# EAGLE schematic Pull out testing jig_modified (EAGLE 7.2.0)
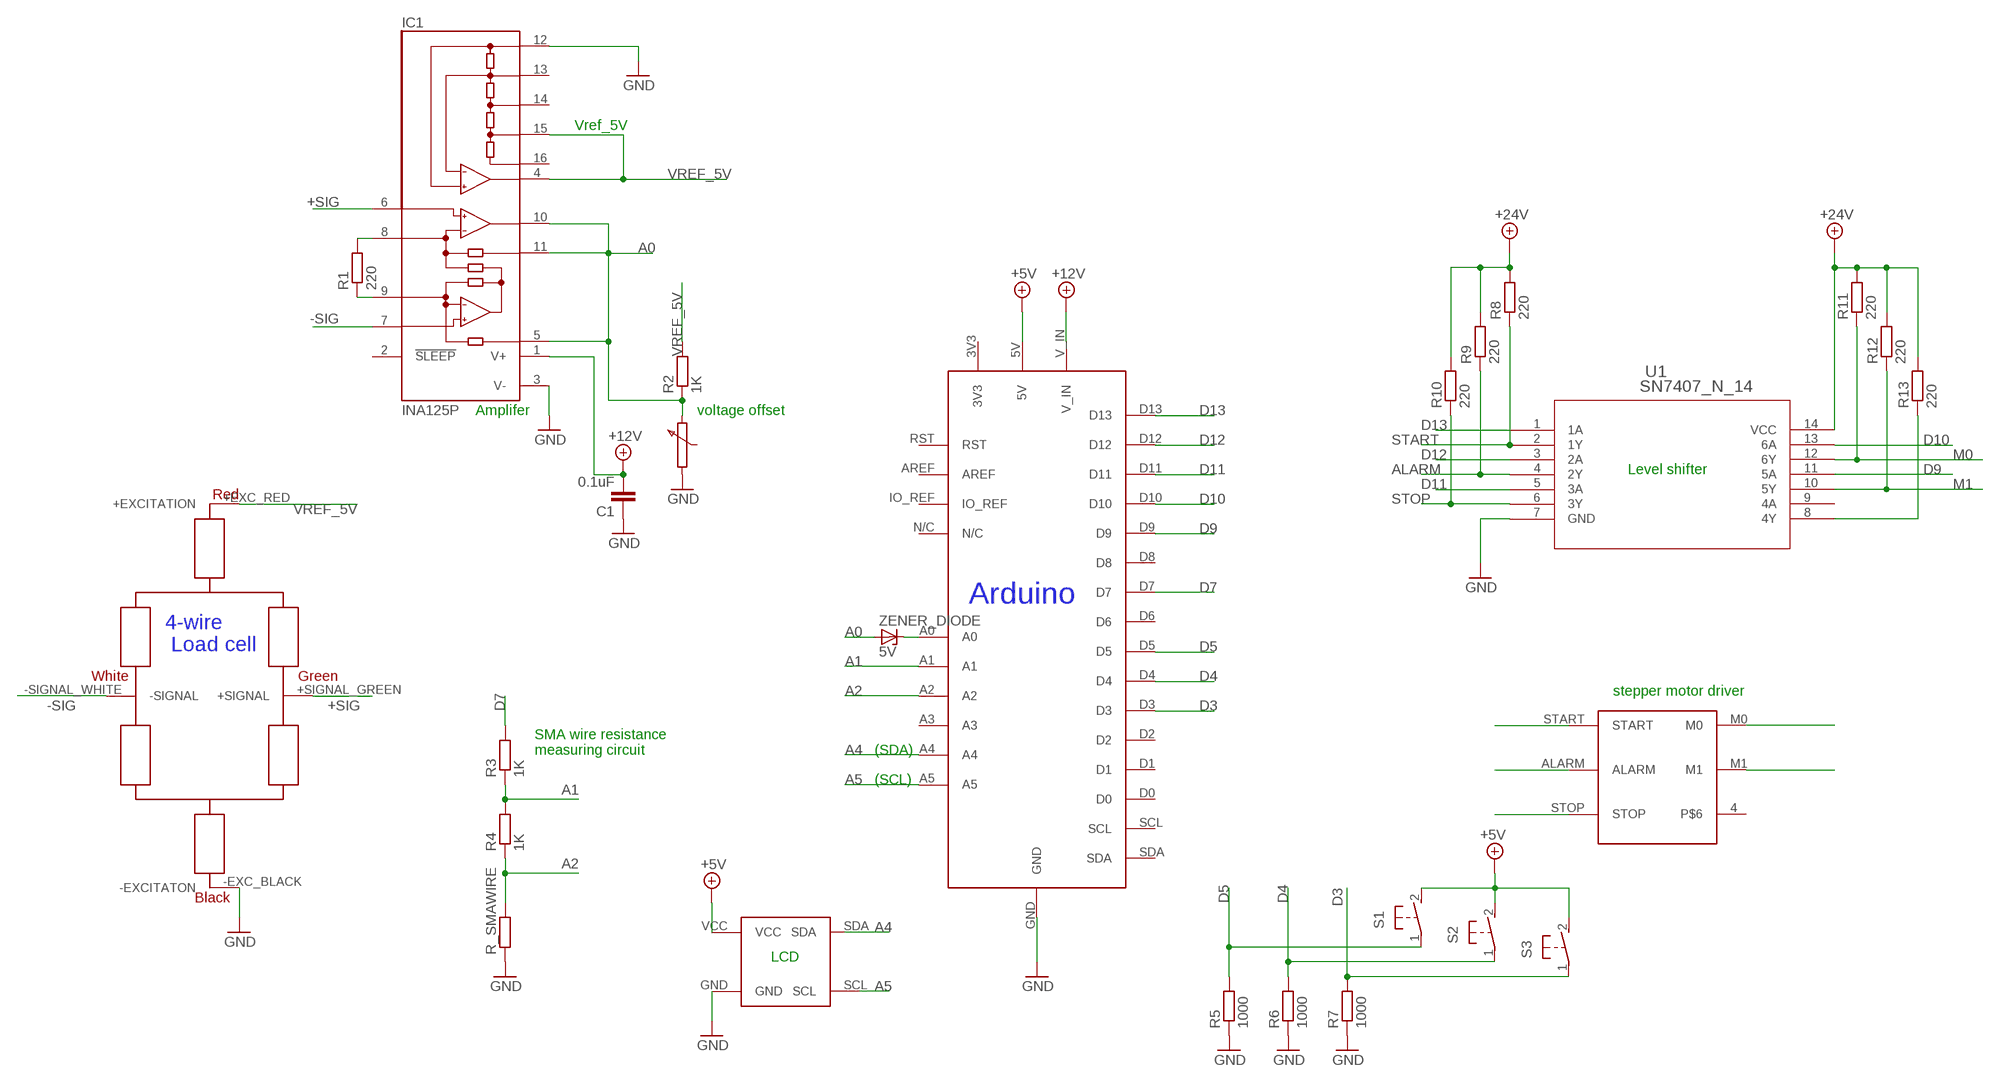
[diagram p0: schematic, sheet 1]

## Parts
C1  0.1uF  C-EU050-024X044  [C050-024X044]
IC1  INA125P  [DIL16]
R1  220  R-EU_0617/17  [0617/17]
R2  1K  R-EU_0207/7  [0207/7]
R3  1K  R-EU_0207/7  [0207/7]
R4  1K  R-EU_0207/7  [0207/7]
R5  1000  R-EU_0204/2V  [0204V]
R6  1000  R-EU_0204/2V  [0204V]
R7  1000  R-EU_0204/2V  [0204V]
R8  220  R-EU_0204/2V  [0204V]
R9  220  R-EU_0204/2V  [0204V]
R10  220  R-EU_0204/2V  [0204V]
R11  220  R-EU_0204/2V  [0204V]
R12  220  R-EU_0204/2V  [0204V]
R13  220  R-EU_0204/2V  [0204V]
R_SMAWIRE  R-EU_0207/7  [0207/7]
S1  31-XX  [B3F-31XX]
S2  31-XX  [B3F-31XX]
S3  31-XX  [B3F-31XX]
U1  SN7407_N_14  [N14]
U$1  ARDUINO_UNO  [ARDUINO_SCHEMATIC]
U$2  4_WIRE_LOADCELL  [4-WIRE_LOADCELL]
U$3  LCD  [LCD]
U$4  STEPMOTOR_IO  [STEPMOTOR_IO]
ZENER_DIODE  5V  ZENER-DIODESMB  [SMB]

## Nets
+5V: S1.2(S) S2.2(S) S3.2(S) U$1.5V U$3.VCC
+12V: C1.2 IC1.1(V+) U$1.V_IN
+24V: R8.2 R9.2 R10.2 R11.2 R12.2 R13.2 U1.14(VCC)
+SIG: IC1.6(+IN) U$2.+SIGNAL_GREEN(+SIGNAL)
-SIG: IC1.7(-IN) U$2.-SIGNAL_WHITE(-SIGNAL)
A0: IC1.5(REF) IC1.10(OUT) IC1.11(SENSE) R2.1 ZENER_DIODE.A
A1: R3.1 R4.2 U$1.A1
A2: R4.1 R_SMAWIRE.2 U$1.A2
A4: U$1.A4
A5: U$1.A5 U$3.SCL
ALARM: R9.1 U1.4(2Y) U$4.ALARM
D3: R7.2 S3.1(P) U$1.D3
D4: R6.2 S2.1(P) U$1.D4
D5: R5.2 S1.1(P) U$1.D5
D7: R3.2 U$1.D7
D9: U1.11(5A) U$1.D9
D10: U1.13(6A) U$1.D10
D11: U1.5(3A) U$1.D11
D12: U1.3(2A) U$1.D12
D13: U1.1(1A) U$1.D13
GND: C1.1 IC1.3(V-) IC1.12(REFCOM) R5.1 R6.1 R7.1 R_SMAWIRE.1 U1.7(GND) U$1.GND U$2.-EXC_BLACK(-EXCITATON) U$3.GND
M0: R11.1 U1.12(6Y) U$4.M0
M1: R12.1 U1.10(5Y) U$4.M1
N$1: U$1.A0 ZENER_DIODE.C
N$5: R13.1 U1.8(4Y)
N$8: IC1.8(RG) R1.2
N$9: IC1.9(RG) R1.1
START: R8.1 U1.2(1Y) U$4.START
STOP: R10.1 U1.6(3Y) U$4.STOP
VREF_5V: IC1.4(REFOUT) IC1.15(REF5) R2.2 U$2.+EXC_RED(+EXCITATION)
Unconnected: IC1.2(!SLEEP) IC1.13(REFBG) IC1.14(REF2.5) IC1.16(REF10) U1.9(4A) U$1.3V3 U$1.A3 U$1.AREF U$1.D0 U$1.D1 U$1.D2 U$1.D6 U$1.D8 U$1.IO_REF U$1.N/C U$1.RST U$1.SCL U$1.SDA U$3.SDA U$4.4

## Notes on the sheet
- Vref_5V
- Amplifer | voltage offset
- Level shifter
- stepper motor driver
- SMA wire resistance
  measuring circuit
- (SDA)
- (SCL)
- LCD

## Library data of the parts
C1 = rcl:C-EU: CAPACITOR, European symbol
IC1 = burr-brown:INA125: Instrumentation Amplifier with Precision Voltage Reference; MF: TEXAS INSTRUMENT CONNECTORS; MPN: INA125P; OC_FARNELL: 1459461; OC_NEWARK: 35C1726
R1 R5-R13 = resistor:R-EU_: RESISTOR, European symbol
R2-R4 R_SMAWIRE = rcl:R-EU_: RESISTOR, European symbol
S1-S3 = switch-omron:31-XX: OMRON SWITCH; MPN: B3F-3100; OC_FARNELL: 959704; OC_NEWARK: 36M3582
U1 = SN7407N:SN7407_N_14; DATASHEETURL: http://www.ti.com/lit/gpn/SN7407; DESCRIPTION: Hex Buffers/Drivers With Open-Collector High-Voltage Outputs; FAMILY_NAME: NON-INVERTING BUFFER/DRIVER; GENERIC_PART_NUMBER: SN7407; INDUSTRY_STD_PKG_TYPE: PDIP; MANUFACTURER: Texas Instruments; PACKAGE_DESIGNATOR: N; PIN_COUNT: 14
U$1 = Arduino R3:ARDUINO_UNO
U$2 = 4-wire-loadcell:4_WIRE_LOADCELL
U$3 = LCD:LCD
U$4 = stepMotorIO:STEPMOTOR_IO
ZENER_DIODE = diode:ZENER-DIODE: Z-Diode